# EAGLE design M651C (EAGLE 4.11)
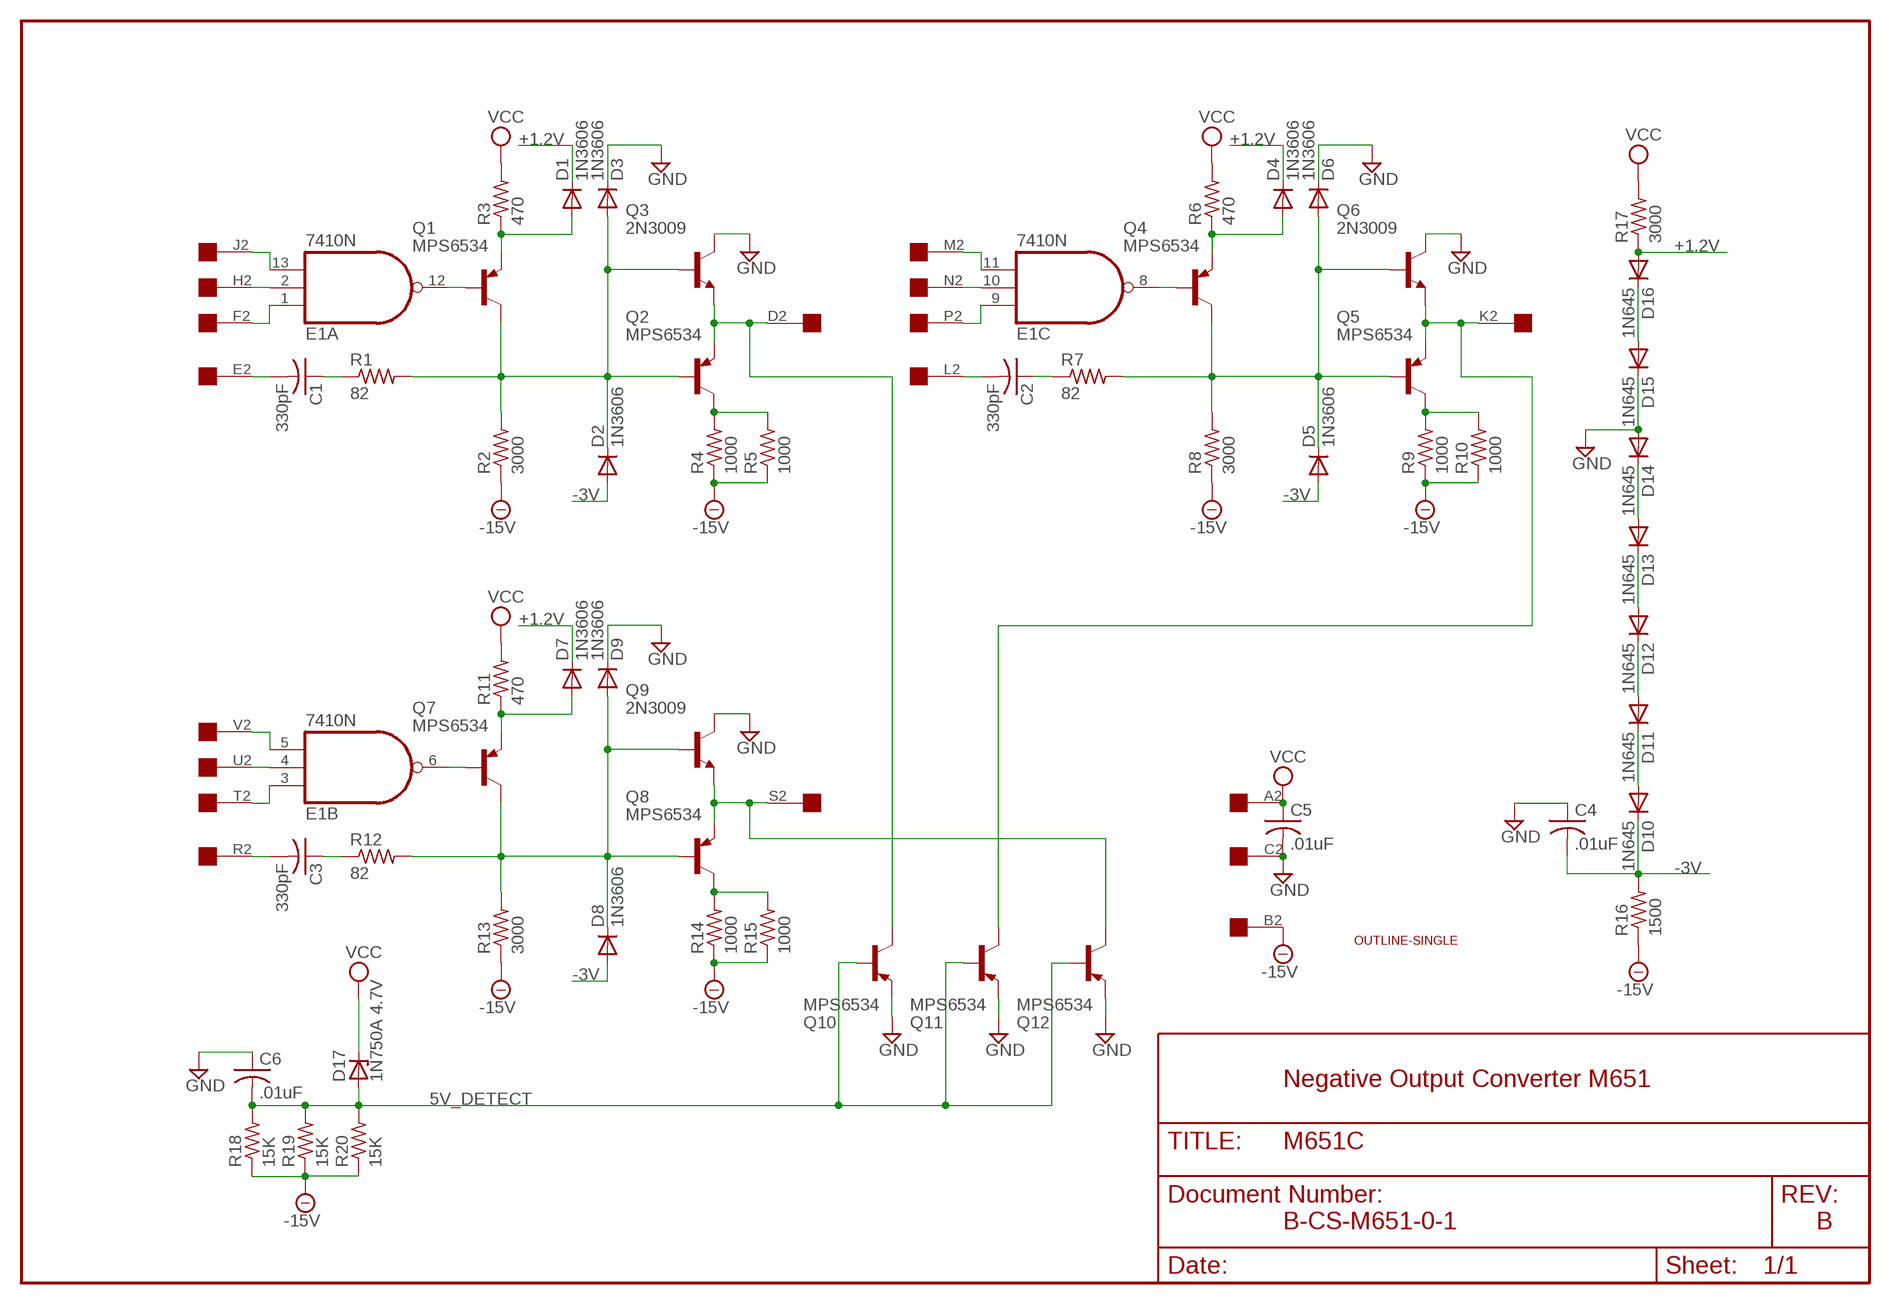
[diagram p0: schematic, sheet 1]

## Parts
C1  330pF  C-US050-025X075  [C050-025X075]
C2  330pF  C-US050-025X075  [C050-025X075]
C3  330pF  C-US050-025X075  [C050-025X075]
C4  .01uF  C-US050-025X075  [C050-025X075]
C5  .01uF  C-US050-025X075  [C050-025X075]
C6  .01uF  C-US050-025X075  [C050-025X075]
D1  1N3606  1N4148  [DO35-10]
D2  1N3606  1N4148  [DO35-10]
D3  1N3606  1N4148  [DO35-10]
D4  1N3606  1N4148  [DO35-10]
D5  1N3606  1N4148  [DO35-10]
D6  1N3606  1N4148  [DO35-10]
D7  1N3606  1N4148  [DO35-10]
D8  1N3606  1N4148  [DO35-10]
D9  1N3606  1N4148  [DO35-10]
D10  1N645  1N4148  [DO35-10]
D11  1N645  1N4148  [DO35-10]
D12  1N645  1N4148  [DO35-10]
D13  1N645  1N4148  [DO35-10]
D14  1N645  1N4148  [DO35-10]
D15  1N645  1N4148  [DO35-10]
D16  1N645  1N4148  [DO35-10]
D17  1N750A 4.7V  ZENER-DIODEDO35Z10  [DO35Z10]
E1  7410N  [DIL14]
Q1  MPS6534  2N5415  [TO39]
Q2  MPS6534  2N5415  [TO39]
Q3  2N3009  2N2219  [TO5]
Q4  MPS6534  2N5415  [TO39]
Q5  MPS6534  2N5415  [TO39]
Q6  2N3009  2N2219  [TO5]
Q7  MPS6534  2N5415  [TO39]
Q8  MPS6534  2N5415  [TO39]
Q9  2N3009  2N2219  [TO5]
Q10  MPS6534  2N5415  [TO39]
Q11  MPS6534  2N5415  [TO39]
Q12  MPS6534  2N5415  [TO39]
R1  82  R-US_0207/10  [0207/10]
R2  3000  R-US_0207/10  [0207/10]
R3  470  R-US_0207/10  [0207/10]
R4  1000  R-US_0207/10  [0207/10]
R5  1000  R-US_0207/10  [0207/10]
R6  470  R-US_0207/10  [0207/10]
R7  82  R-US_0207/10  [0207/10]
R8  3000  R-US_0207/10  [0207/10]
R9  1000  R-US_0207/10  [0207/10]
R10  1000  R-US_0207/10  [0207/10]
R11  470  R-US_0207/10  [0207/10]
R12  82  R-US_0207/10  [0207/10]
R13  3000  R-US_0207/10  [0207/10]
R14  1000  R-US_0207/10  [0207/10]
R15  1000  R-US_0207/10  [0207/10]
R16  1500  R-US_0207/10  [0207/10]
R17  3000  R-US_0207/10  [0207/10]
R18  15K  R-US_0207/10  [0207/10]
R19  15K  R-US_0207/10  [0207/10]
R20  15K  R-US_0207/10  [0207/10]
U$1  OUTLINE-SINGLE  [SINGLE]
U$3  EDGE-1  [EDGE-CON1]

## Nets
5V_DETECT: C6.2 D17.A Q10.2(B) Q11.2(B) Q12.2(B) R18.2 R19.2 R20.2
+1.2V [Supply]: D1.C D4.C D7.C D16.A R17.1
-3V [Supply]: C4.2 D2.A D5.A D8.A D10.C R16.2
-15V: R2.1 R4.1 R5.1 R8.1 R9.1 R10.1 R13.1 R14.1 R15.1 R16.1 R18.1 R19.1 R20.1 U$3.B2
GND [Supply]: C4.1 C5.2 C6.1 D3.C D6.C D9.C D14.A D15.C Q3.3(C) Q6.3(C) Q9.3(C) Q10.1(E) Q11.1(E) Q12.1(E) U$3.C2
N$1: E1.2(A:I1) U$3.H2
N$2: C1.2 U$3.E2
N$3: C1.1 R1.1
N$4: E1.12(A:O) Q1.2(B)
N$5: D1.A Q1.1(E) R3.1
N$6: D2.C D3.A Q1.3(C) Q2.2(B) Q3.2(B) R1.2 R2.2
N$7: Q2.1(E) Q3.1(E) Q10.3(C) U$3.D2
N$8: Q2.3(C) R4.2 R5.2
N$9: E1.9(C:I0) U$3.P2
N$10: E1.11(C:I2) U$3.M2
N$11: E1.10(C:I1) U$3.N2
N$12: E1.8(C:O) Q4.2(B)
N$13: D4.A Q4.1(E) R6.1
N$14: E1.1(A:I0) U$3.F2
N$15: E1.13(A:I2) U$3.J2
N$16: C2.2 U$3.L2
N$17: C2.1 R7.1
N$18: D5.C D6.A Q4.3(C) Q5.2(B) Q6.2(B) R7.2 R8.2
N$19: Q5.1(E) Q6.1(E) Q11.3(C) U$3.K2
N$20: Q5.3(C) R9.2 R10.2
N$21: E1.3(B:I0) U$3.T2
N$22: E1.5(B:I2) U$3.V2
N$23: E1.4(B:I1) U$3.U2
N$24: E1.6(B:O) Q7.2(B)
N$25: D7.A Q7.1(E) R11.1
N$26: C3.2 U$3.R2
N$27: C3.1 R12.1
N$28: D8.C D9.A Q7.3(C) Q8.2(B) Q9.2(B) R12.2 R13.2
N$29: Q8.1(E) Q9.1(E) Q12.3(C) U$3.S2
N$30: Q8.3(C) R14.2 R15.2
N$32 [Supply]: D10.A D11.C
N$33 [Supply]: D11.A D12.C
N$34 [Supply]: D12.A D13.C
N$35 [Supply]: D13.A D14.C
N$37 [Supply]: D15.A D16.C
VCC [Supply]: C5.1 D17.C R3.2 R6.2 R11.2 R17.2 U$3.A2

## Notes on the sheet
- Negative Output Converter M651
- B-CS-M651-0-1 | B

## Power pins joined to a net without a drawn wire
GND: E1.7(P:GND)
VCC: E1.14(P:VCC)

## Library data of the parts
C1-C6 = rcl:C-US: CAPACITOR, American symbol
D1-D16 = diode:1N4148: DIODE high speed (Philips)
D17 = diode:ZENER-DIODE: Z-Diode
E1 = 74xx-us:74*10: Triple 3-input NAND gate
Q1 Q2 Q4 Q5 Q7 Q8 Q10-Q12 = transistor-pnp:2N5415*: PNP Transistror
Q3 Q6 Q9 = transistor-npn:2N2219: NPN Transistor
R1-R20 = rcl:R-US_: RESISTOR, American symbol
U$1 = dec-con:OUTLINE-*: Board outlines for DEC boards.
U$3 = dec-con:EDGE-1: Single-Sided DEC Edge Connector -- (side 2)

## Net classes
1 Supply: width 0.813 mm

## Board
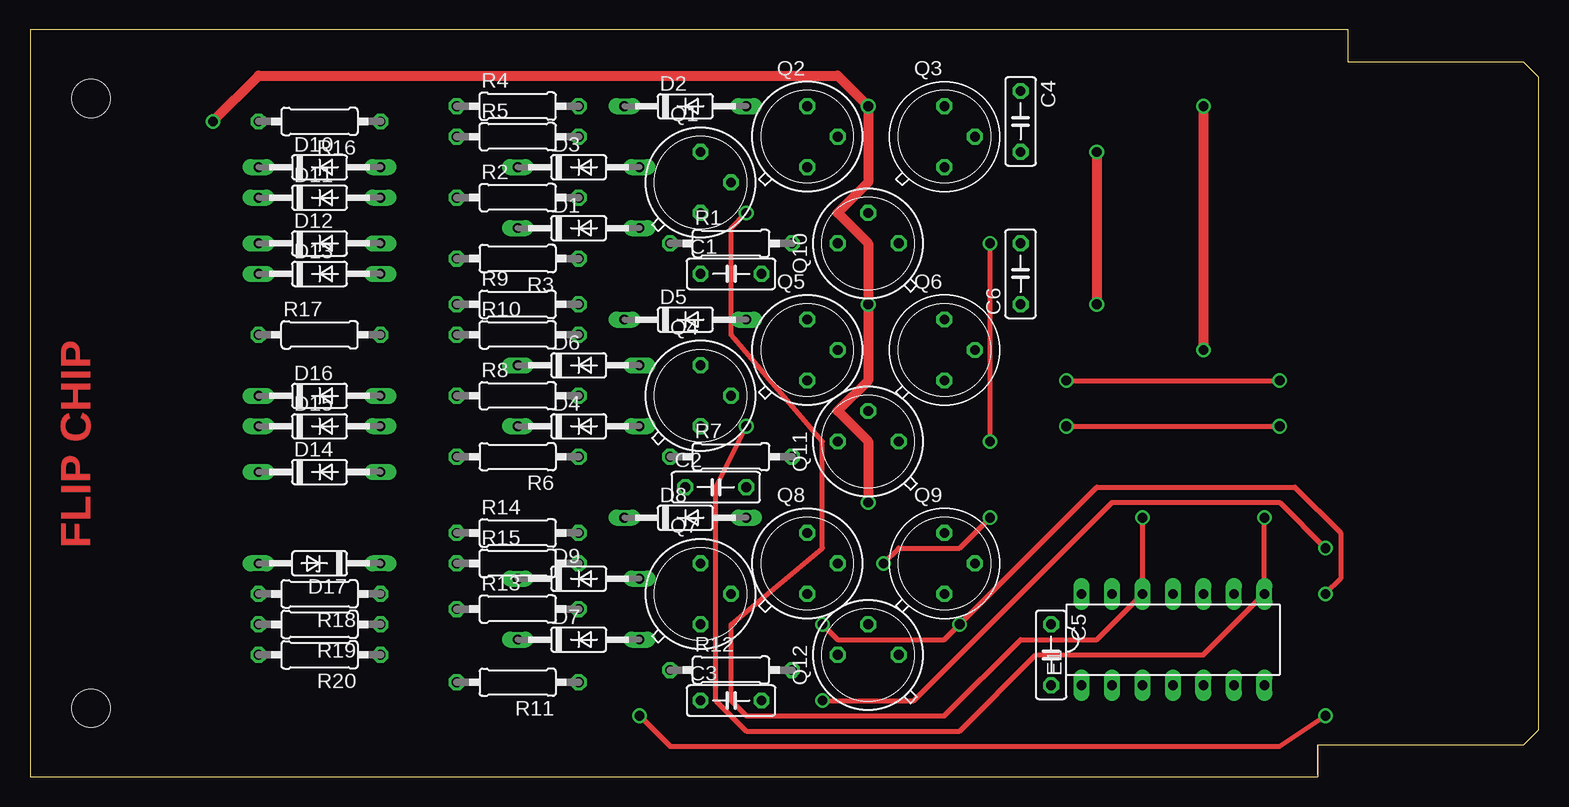
[diagram p1: board, top side]
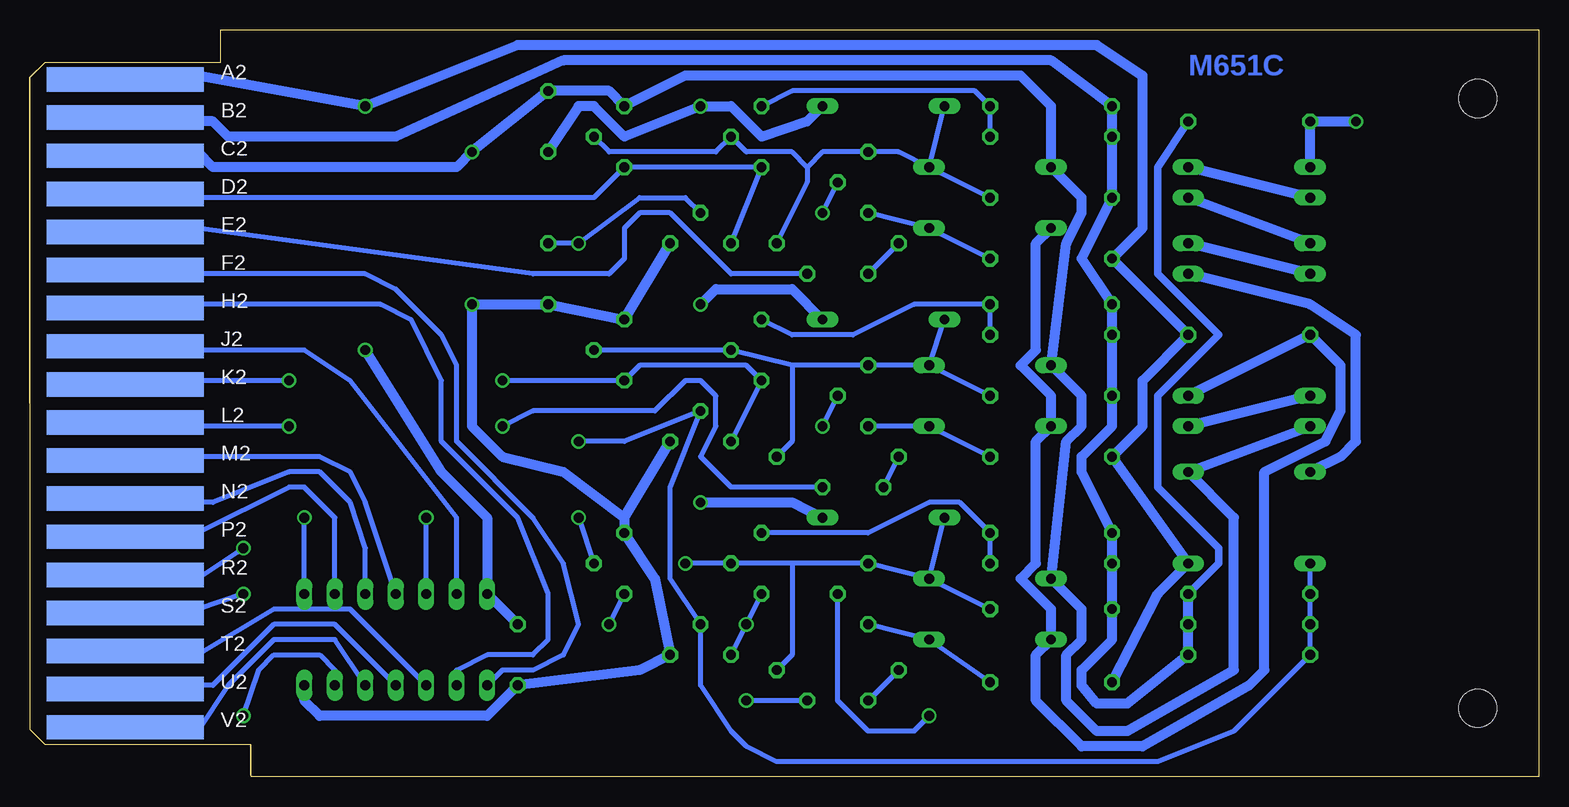
[diagram p2: board, bottom side, seen from below]

Size 125.73 x 62.23 mm. Coordinates in mm from the lower left corner, seen from the top.
Copper layers (1+16): Top 0.035mm / dielectric 1.5mm / Bottom 0.035mm
Design rules "16mils": minimum track width 16mil, minimum drill 32mil, track to track 15mil, track to pad 10mil, pad to pad 10mil, via to via 10mil, smd to smd 10mil, copper to edge 13mil, drill to drill 10mil, minimum pad ring 10mil, minimum via ring 8mil, stop-mask expansion 0mil, vias tented up to drill 0mil, thermal gap 10mil

### Footprints (pad centres in the part's own frame; a part is rotated, then mirrored left to right if it is on the bottom)
C050-025X075 = drill 0.813 octagon: 1 -2.54,0; 2 2.54,0
DO35-10 = drill 0.813 long: A 5.08,0; C -5.08,0
DO35Z10 = drill 0.813 long: A 5.08,0; C -5.08,0
DIL14 = drill 0.813 long: 1 -7.62,-3.81; 2 -5.08,-3.81; 3 -2.54,-3.81; 4 0,-3.81; 5 2.54,-3.81; 6 5.08,-3.81; 7 7.62,-3.81; 8 7.62,3.81; 9 5.08,3.81; 10 2.54,3.81; 11 0,3.81; 12 -2.54,3.81; 13 -5.08,3.81; 14 -7.62,3.81
TO39 = drill 0.813 octagon: 1 0,-2.54; 2 2.54,0; 3 0,2.54
TO5 = drill 0.813 octagon: 1 0,-2.54; 2 2.54,0; 3 0,2.54
0207/10 = drill 0.813 octagon: 1 -5.08,0; 2 5.08,0
SINGLE = hole 3.175: 120.65,56.515; 120.65,5.715
EDGE-CON1 = smd 13.106 x 2.032 bottom: A2 7.938,4.128; B2 7.938,7.303; C2 7.938,10.477; D2 7.938,13.652; E2 7.938,16.828; F2 7.938,20.003; H2 7.938,23.177; J2 7.938,26.352; K2 7.938,29.527; L2 7.938,32.703; M2 7.938,35.877; N2 7.938,39.053; P2 7.938,42.227; R2 7.938,45.403; S2 7.938,48.578; T2 7.938,51.752; U2 7.938,54.928; V2 7.938,58.102

### Placement (x,y rotation side)
C1  58.42,41.91 0 top
C2  57.15,24.13 0 top
C3  58.42,6.35 0 top
C4  82.55,54.61 270 top
C5  85.09,10.16 270 top
C6  82.55,41.91 90 top
D1  45.72,45.72 0 top
D2  54.61,55.88 0 top
D3  45.72,50.8 0 top
D4  45.72,29.21 0 top
D5  54.61,38.1 0 top
D6  45.72,34.29 0 top
D7  45.72,11.43 0 top
D8  54.61,21.59 0 top
D9  45.72,16.51 0 top
D10  24.13,50.8 0 top
D11  24.13,48.26 0 top
D12  24.13,44.45 0 top
D13  24.13,41.91 0 top
D14  24.13,25.4 0 top
D15  24.13,29.21 0 top
D16  24.13,31.75 0 top
D17  24.13,17.78 180 top
E1  95.25,11.43 0 top
Q1  55.88,49.53 0 top
Q2  64.77,53.34 0 top
Q3  76.2,53.34 0 top
Q4  55.88,31.75 0 top
Q5  64.77,35.56 0 top
Q6  76.2,35.56 0 top
Q7  55.88,15.24 0 top
Q8  64.77,17.78 0 top
Q9  76.2,17.78 0 top
Q10  69.85,44.45 90 top
Q11  69.85,27.94 90 top
Q12  69.85,10.16 90 top
R1  58.42,44.45 0 top
R2  40.64,48.26 0 top
R3  40.64,43.18 180 top
R4  40.64,55.88 0 top
R5  40.64,53.34 0 top
R6  40.64,26.67 180 top
R7  58.42,26.67 0 top
R8  40.64,31.75 0 top
R9  40.64,39.37 0 top
R10  40.64,36.83 0 top
R11  40.64,7.87 180 top
R12  58.42,8.89 0 top
R13  40.64,13.97 0 top
R14  40.64,20.32 0 top
R15  40.64,17.78 0 top
R16  24.13,54.61 180 top
R17  24.13,36.83 0 top
R18  24.13,15.24 180 top
R19  24.13,12.7 180 top
R20  24.13,10.16 180 top
U$1  125.73,62.23 180 top
U$2  [FLIPCHIP]  0,0 0 top
U$3  125.73,62.23 180 top

### Tracks (layer width: path | path; a pad name or v marks a point on that pad's centre or on a via)
5V_DETECT  (via drill 0.81)
  Top 0.406: v80.01,27.94 v80.01,44.45
  Bottom 0.406: Q10.2 71.12,48.26 74.93,48.26 v80.01,44.45 C6.2 | D17.A R18.2 R19.2 R20.2 25.4,3.81 31.75,1.27 63.5,1.27 66.04,2.54 67.31,3.81 69.85,7.62 Q12.2 72.39,16.51 72.39,24.13 Q11.2 76.2,27.94 v80.01,27.94
+1.2V
  Bottom 0.813: D1.C 41.91,44.45 41.91,35.56 43.18,34.29 40.64,31.75 D4.C 41.91,27.94 41.91,17.78 43.18,16.51 40.64,13.97 D7.C 41.91,10.16 41.91,6.35 38.1,2.54 33.02,2.54 24.13,7.62 22.86,8.89 22.86,25.4 17.78,27.94 16.51,30.48 16.51,34.29 R17.1 D16.A
-3V  (via drill 0.81)
  Top 0.813: v15.24,54.61 19.05,58.42 67.31,58.42 v69.85,55.88 69.85,49.53 67.31,46.99 69.85,44.45 v69.85,39.37 69.85,33.02 67.31,30.48 69.85,27.94 v69.85,22.86
  Bottom 0.813: D2.A 60.96,54.61 64.77,53.34 67.31,55.88 v69.85,55.88 76.2,53.34 78.74,55.88 80.01,55.88 C4.2 | D10.C R16.2 v15.24,54.61 | D8.A 62.23,22.86 v69.85,22.86 | D5.A 62.23,40.64 68.58,40.64 v69.85,39.37
-15V
  Bottom 0.61: R18.1 26.67,17.78 26.67,19.05 31.75,24.13 31.75,31.75 26.67,36.83 31.75,41.91 31.75,50.8 R16.1
  Bottom 0.813: U$3.B2 116.84,54.61 110.49,54.61 109.22,53.34 95.25,53.34 81.28,59.69 40.64,59.69 R4.1 R5.1 R2.1 38.1,43.18 R9.1 R10.1 R8.1 35.56,29.21 38.1,26.67 38.1,25.4 R14.1 R15.1 R13.1 35.56,11.43 38.1,8.89 38.1,7.62 36.83,6.1 34.29,6.1 R20.1 R19.1 R18.1
GND  (via drill 0.81)
  Top 0.813: v88.9,52.07 v88.9,39.37
  Bottom 0.813: U$3.C2 116.84,52.07 111.76,52.07 110.49,50.8 90.17,50.8 v88.9,52.07 C4.1 77.47,57.15 Q3.3 71.12,58.42 43.18,58.42 40.64,55.88 D3.C 38.1,48.26 38.1,46.99 39.37,44.45 D6.C 38.1,31.75 38.1,29.21 39.37,27.94 D9.C 38.1,13.97 38.1,11.43 39.37,10.16 39.37,6.35 36.83,3.81 34.29,3.81 25.4,8.89 25.4,21.59 D14.A D15.C | Q10.1 Q6.3 C6.1 v88.9,39.37 88.9,29.21 86.36,26.67 81.28,25.4 76.2,21.59 | E1.7 102.87,6.35 101.6,5.08 87.63,5.08 C5.2 74.93,8.89 Q12.1 73.66,16.51 Q9.3 76.2,21.59 | 76.2,21.59 Q11.1
N$1
  Bottom 0.406: E1.2 90.17,8.89 87.63,10.16 83.82,10.16 82.55,11.43 82.55,15.24 85.09,21.59 91.44,27.94 91.44,33.02 93.98,38.1 96.52,39.37 116.84,39.37 U$3.H2
N$2
  Bottom 0.406: U$3.E2 116.84,45.72 111.76,45.72 83.82,41.91 77.47,41.91 76.2,43.18 76.2,45.72 74.93,46.99 72.39,46.99 67.31,41.91 C1.2
N$3
  Bottom 0.406: R1.1 C1.1
N$4  (via drill 0.81)
  Top 0.406: v92.71,21.59 E1.12 88.9,11.43 82.55,11.43 76.2,5.08 59.69,5.08 58.42,6.35 58.42,12.7 66.04,19.05 66.04,27.94 58.42,36.83 58.42,45.72 v59.69,46.99
  Bottom 0.406: E1.12 v92.71,21.59 | v59.69,46.99 Q1.2
N$5
  Bottom 0.406: R3.1 D1.A Q1.1
N$6
  Bottom 0.406: 60.96,50.8 62.23,52.07 66.04,52.07 Q2.2 68.58,52.07 77.47,52.07 Q3.2 | 60.96,50.8 60.96,49.53 R1.2 | D3.A D2.C | D3.A 53.34,52.07 Q1.3 59.69,52.07 60.96,50.8 | R2.2 D3.A
N$7
  Bottom 0.406: U$3.D2 116.84,48.26 78.74,48.26 Q3.1 Q2.1 Q10.3
N$8
  Bottom 0.406: Q2.3 62.23,57.15 46.99,57.15 R4.2 R5.2
N$9
  Bottom 0.406: U$3.P2 116.84,20.32 111.76,20.32 104.14,24.13 102.87,24.13 100.33,21.59 E1.9
N$10
  Bottom 0.406: U$3.M2 116.84,26.67 101.6,26.67 99.06,25.4 97.79,22.86 E1.11
N$11
  Bottom 0.406: U$3.N2 116.84,22.86 110.49,22.86 104.14,25.4 101.6,25.4 99.06,22.86 97.79,19.05 E1.10
N$12  (via drill 0.81)
  Top 0.406: v102.87,21.59 E1.8 97.79,10.16 83.82,10.16 77.47,3.81 59.69,3.81 57.15,6.35 57.15,24.13 v59.69,29.21
  Bottom 0.406: E1.8 v102.87,21.59 | v59.69,29.21 Q4.2
N$13
  Bottom 0.406: R6.1 D4.A Q4.1
N$14
  Bottom 0.406: U$3.F2 116.84,41.91 97.79,41.91 95.25,40.64 91.44,36.83 90.17,34.29 90.17,27.94 83.82,21.59 81.28,17.78 80.01,12.7 81.28,10.16 83.82,8.89 86.36,8.89 E1.1
N$15
  Bottom 0.406: U$3.J2 116.84,35.56 102.87,35.56 99.06,33.02 90.17,21.59 E1.13
N$16  (via drill 0.81)
  Top 0.406: v86.36,29.21 v104.14,29.21
  Bottom 0.406: U$3.L2 116.84,29.21 v104.14,29.21 | C2.2 67.31,24.13 69.85,26.67 68.58,29.21 68.58,31.75 69.85,33.02 71.12,33.02 73.66,30.48 83.82,30.48 v86.36,29.21
N$17
  Bottom 0.406: C2.1 R7.1
N$18
  Bottom 0.406: D6.A D5.C | R8.2 D6.A | D6.A Q4.3 62.23,34.29 | Q6.2 Q5.2 62.23,34.29 | R7.2 62.23,27.94 62.23,34.29
N$19  (via drill 0.81)
  Top 0.406: v86.36,33.02 v104.14,33.02
  Bottom 0.406: U$3.K2 116.84,33.02 v104.14,33.02 | v86.36,33.02 Q6.1 74.93,34.29 66.04,34.29 Q5.1 Q11.3
N$20
  Bottom 0.406: R10.2 R9.2 52.07,39.37 57.15,36.83 62.23,36.83 Q5.3
N$21
  Bottom 0.406: U$3.T2 116.84,10.16 111.76,10.16 105.41,13.97 99.06,13.97 E1.3
N$22
  Bottom 0.406: U$3.V2 116.84,3.81 111.76,3.81 109.22,7.62 105.41,11.43 100.33,11.43 E1.5
N$23
  Bottom 0.406: U$3.U2 116.84,7.62 110.49,7.62 105.41,12.7 100.33,12.7 E1.4
N$24  (via drill 0.81)
  Top 0.406: v107.95,5.08 104.14,2.54 53.34,2.54 v50.8,5.08
  Bottom 0.406: E1.6 100.33,8.89 101.6,10.16 105.41,10.16 106.68,8.89 v107.95,5.08 | Q7.2 58.42,6.35 55.88,3.81 52.07,3.81 v50.8,5.08
N$25
  Bottom 0.406: R11.1 D7.A Q7.1
N$26  (via drill 0.81)
  Top 0.406: v107.95,19.05 104.14,22.86 90.17,22.86 73.66,6.35 v66.04,6.35
  Bottom 0.406: U$3.R2 116.84,16.51 111.76,16.51 v107.95,19.05 | C3.2 v66.04,6.35
N$27
  Bottom 0.406: R12.1 C3.1
N$28  (via drill 0.81)
  Top 0.406: v71.12,17.78 72.39,19.05 77.47,19.05 v80.01,21.59
  Bottom 0.406: D9.A D8.C | D9.A Q7.3 62.23,17.78 | R13.2 D9.A | 62.23,17.78 Q8.2 v71.12,17.78 | R12.2 62.23,10.16 62.23,17.78 | v80.01,21.59 Q9.2
N$29  (via drill 0.81)
  Top 0.406: v66.04,12.7 67.31,11.43 76.2,11.43 v77.47,12.7 88.9,24.13 105.41,24.13 109.22,20.32 109.22,16.51 v107.95,15.24
  Bottom 0.406: U$3.S2 116.84,13.97 111.76,13.97 v107.95,15.24 | Q12.3 v66.04,12.7 Q8.1 | v77.47,12.7 Q9.1
N$30
  Bottom 0.406: R15.2 R14.2 48.26,22.86 50.8,22.86 55.88,20.32 Q8.3
N$32
  Bottom 0.813: D11.C D10.A
N$33
  Bottom 0.813: D12.C D11.A
N$34
  Bottom 0.813: D13.C D12.A
N$35
  Bottom 0.813: D14.C 16.51,26.67 15.24,27.94 15.24,36.83 19.05,39.37 D13.A
N$37
  Bottom 0.813: D16.C D15.A
VCC  (via drill 0.81)
  Top 0.813: v97.79,55.88 v97.79,35.56
  Bottom 0.813: U$3.A2 117.22,58.04 116.84,58.42 111.76,58.42 v97.79,55.88 85.09,60.96 36.83,60.96 33.02,58.42 33.02,45.72 R3.2 R17.2 33.02,33.02 33.02,29.21 R6.2 D17.C 31.75,15.24 R11.2 | v97.79,35.56 91.44,25.4 87.63,21.59 E1.14 C5.1

### Text on the board
Bottom: M651C